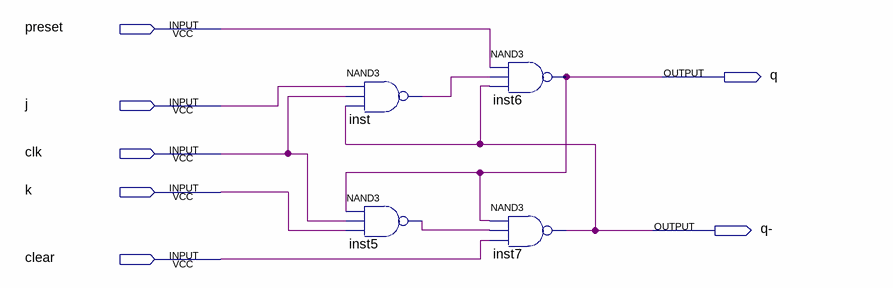
[diagram p0: schematic sheet]
// Quartus schematic ffjk.bdf as structural Verilog: 4 symbols, 7 pins
module ffjk (
  input  preset,
  input  j,
  input  clk,
  input  k,
  input  clear,
  output q,
  output \q- 
);

  wire inst5_out, inst_out;

  nand inst (inst_out, j, clk, \q- );
  nand inst5 (inst5_out, q, clk, k);
  nand inst6 (q, preset, inst_out, \q- );
  nand inst7 (\q- , q, inst5_out, clear);
endmodule
